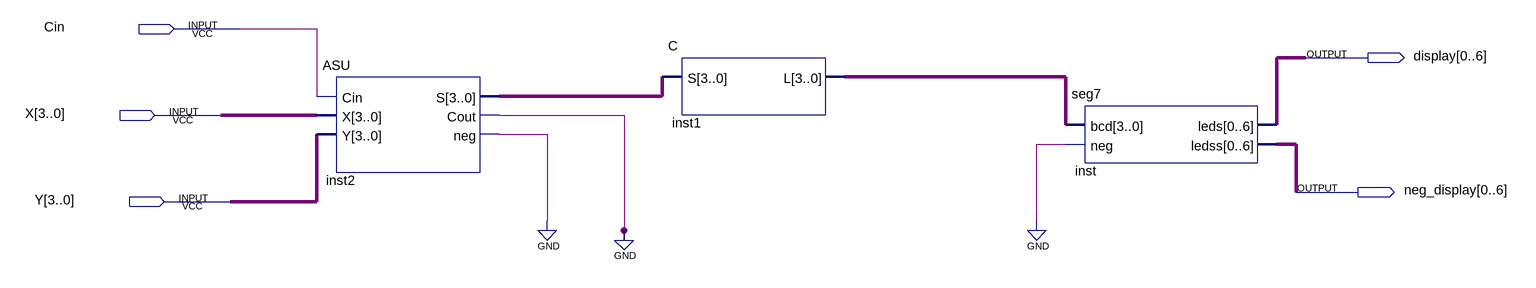
[diagram p0: schematic sheet]
// Quartus schematic circuit2.bdf as structural Verilog: 3 symbols, 5 pins
module circuit2 (
  input  Cin,
  input  [3:0] X,
  input  [3:0] Y,
  output [0:6] display,
  output [0:6] neg_display
);

  wire inst2_cout, inst2_neg;
  wire [3:0] inst1_l, inst2_s;

  ASU inst2 (.Cin(Cin), .X(X), .Y(Y), .S(inst2_s), .Cout(inst2_cout), .neg(inst2_neg));
  C inst1 (.S(inst2_s), .L(inst1_l));
  seg7 inst (.bcd(inst1_l), .neg(1'b0), .leds(display), .ledss(neg_display));
  // also tied to GND on the sheet: {inst2_neg, inst2_cout}
endmodule
